# EAGLE design booster (EAGLE 7.7.0)
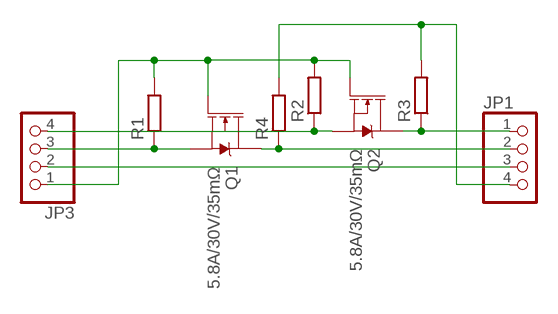
[diagram p0: schematic, sheet 1]

## Parts
JP1  PINHD-1X4/90  [1X04/90]
JP3  PINHD-1X4/90  [1X04/90]
Q1  5.8A/30V/35mΩ  MOSFET-NCH-AO3404A  [SOT23-3]
Q2  5.8A/30V/35mΩ  MOSFET-NCH-AO3404A  [SOT23-3]
R1  R-EU_R0805  [R0805]
R2  R-EU_R0805  [R0805]
R3  R-EU_R0805  [R0805]
R4  R-EU_R0805  [R0805]

## Nets
N$1: JP3.3 Q1.2(S) R1.1
N$2: JP1.2 Q1.3(D) R4.1
N$3: JP1.1 Q2.3(D) R3.1
N$4: JP3.4 Q2.2(S) R2.1
N$5: JP1.4 R3.2 R4.2
N$6: JP1.3 JP3.2
N$7: JP3.1 Q1.1(G) Q2.1(G) R1.2 R2.2

## Library data of the parts
JP1 JP3 = pinhead:PINHD-1X4: PIN HEADER
Q1 Q2 = SparkFun-DiscreteSemi:MOSFET-NCH: N-channel MOSFETs Voltage controlled devices that allow control of high current outputs. SparkFun Products: SparkFun OpenScale <https://www.sparkfun.com/products/13261> SparkFun Digital Sandbox <https://www.sparkfun.com/products/12651> SparkFun Monster Moto Shield <https://www.sparkfun.com/products/10182> SparkFun MOSFET Power Controller <https://www.sparkfun.com/products/11214>; PROD_ID: TRANS-12988
R1-R4 = resistor:R-EU_: RESISTOR, European symbol

## Board
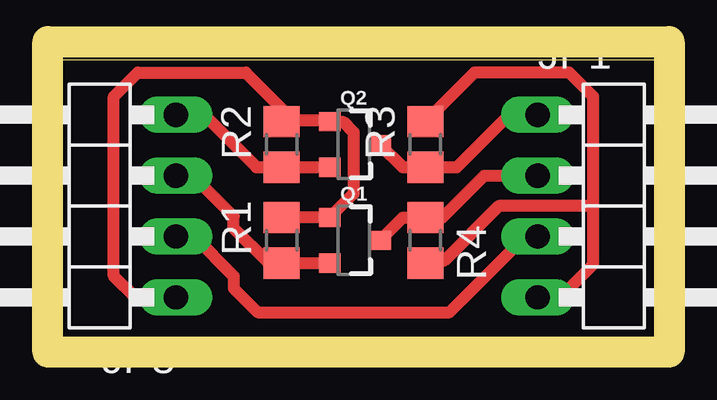
[diagram p1: board, top side]

Size 24.89 x 11.68 mm. Coordinates in mm from the lower left corner, seen from the top.
Outline: 0,0 24.89,0 24.89,11.68 0,11.68 0,0
Copper layers (1*16): Top 0.035mm / dielectric 1.5mm / Bottom 0.035mm
Design rules "default": minimum track width 10mil, minimum drill 24mil, track to track 8mil, track to pad 8mil, pad to pad 8mil, via to via 8mil, smd to smd 8mil, copper to edge 40mil, drill to drill 8mil, minimum pad ring 10mil, minimum via ring 8mil, stop-mask expansion 4mil, vias tented up to drill 0mil, thermal gap 10mil
Milling: 4 lines

### Footprints (pad centres in the part's own frame; a part is rotated, then mirrored left to right if it is on the bottom)
1X04/90 = drill 1.016 long: 1 -3.81,-3.81; 2 -1.27,-3.81; 3 1.27,-3.81; 4 3.81,-3.81
SOT23-3 = smd 0.8 x 0.9: 1 -0.95,-1; 2 0.95,-1; 3 0,1.1
R0805 = smd 1.3 x 1.5: 1 -0.95,0; 2 0.95,0

### Placement (x,y rotation side)
JP1  23.73,5.59 270 top
JP3  1.02,5.59 90 top
Q1  12.25,4.16 270 top
Q2  12.25,8.16 270 top
R1  9.25,4.16 90 top
R2  9.25,8.16 90 top
R3  15.24,8.16 90 top
R4  15.24,4.16 270 top

### Tracks (layer width: path | path; a pad name or v marks a point on that pad's centre or on a via)
N$1
  Top 0.5: Q1.2 R1.1 8.7,3.21 7.25,4.66 7.25,5.16 5.75,6.66 5.03,6.66 JP3.3
N$2
  Top 0.5: Q1.3 14.3,5.11 R4.1 15.94,5.11 17.69,6.86 JP1.2
N$3
  Top 0.5: Q2.3 14.3,7.21 R3.1 16.54,7.21 18.73,9.4 JP1.1
N$4
  Top 0.5: JP3.4 6.01,9.4 8.2,7.21 R2.1 Q2.2
N$5
  Top 0.5: JP1.4 20.86,1.78 22.24,3.16 22.24,5.59 | 22.24,5.59 22.24,10.16 21.24,11.16 17.29,11.16 R3.2 | 22.24,5.59 18.29,5.59 16,3.3 15.84,3.3 R4.2
N$6
  Top 0.5: JP3.2 5.59,4.32 7.25,2.66 7.25,2.16 8.25,1.16 16.25,1.16 19.25,4.16 19.76,4.16 JP1.3
N$7
  Top 0.5: 9.75,9.16 11.2,9.16 Q2.1 11.8,9.11 12.25,8.66 12.25,6.11 Q1.1 R1.2 | 9.75,9.16 9.3,9.16 R2.2 | JP3.1 3.13,1.78 2.25,2.66 2.25,10.16 3.25,11.16 7.75,11.16 9.75,9.16